# Altium project MB1189.PrjPCB (part 3 of 3)
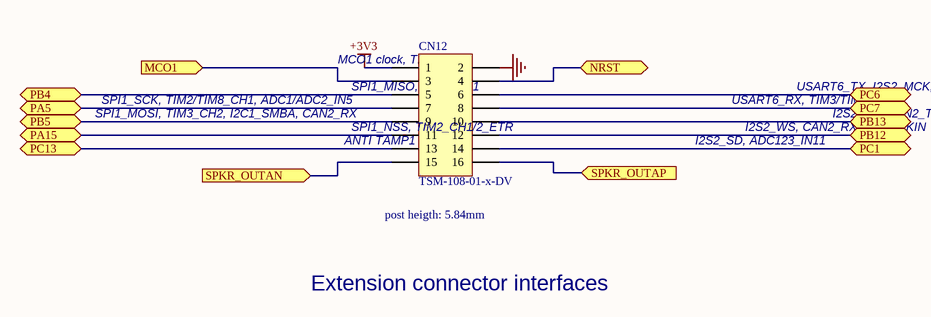
[diagram p13: ExtensionConnector.SchDoc]

## Nets that join several sheets
+1V8: Power (C32.1 U8.2 U8.4), AUDIO2 (7 pins)
+3V3: Memory (28 pins), Peripherals (15 pins), Power (C41.1 JP5.1 SB8.2 U8.3), ST_LINK_V2-1 (R33.1), MCU (7 pins), Arduino_ Connectors (CN6.2 CN6.4), DSI_LCD (9 pins), QSPI (C62.1 R55.2 U12.8), AUDIO2 (11 pins), USB_OTG_FS (R43.1 R153.2 R157.1 R158.2), ExtensionConnector (CN12.1)
+5V: Power (6 pins), ST_LINK_V2-1 (D1.1), Arduino_ Connectors (CN6.5), DSI_LCD (L1.1 SB13.1), USB_OTG_FS (U16.5)
E5V: Power (C35.1 JP2.1 U10.2 U10.4), ST_LINK_V2-1 (D2.1)
GND: Top (H1.1 H2.1 H3.1 H4.1), Memory (28 pins), Peripherals (7 pins), Power (12 pins), ST_LINK_V2-1 (34 pins), MCU (57 pins), Arduino_ Connectors (5 pins), DSI_LCD (12 pins), QSPI (C62.2 U12.4), AUDIO2 (28 pins), USB_OTG_FS (12 pins), ExtensionConnector (CN12.2)
U5V_ST_LINK: Power (JP2.3), ST_LINK_V2-1 (C14.2 U4.6 U4.7)
VBUS_FS1: Power (JP2.5), ST_LINK_V2-1 (D3.1), MCU (U14.E15), USB_OTG_FS (5 pins)
VDD_MCU: Power (JP5.2), MCU (40 pins)
VIN: Power (C36.1 U10.3), Arduino_ Connectors (CN6.8)
VREF+: MCU (C78.2 C80.1 R123.2 U14.P1), Arduino_ Connectors (C13.2 R41.1)
A0: Memory (U11.G8), MCU (U14.D2)
A1: Memory (U11.G9), MCU (U14.E2)
A2: Memory (U11.F7), MCU (U14.G2)
A3: Memory (U11.F3), MCU (U14.H2)
A4: Memory (U11.G1), MCU (U14.J2)
A5: Memory (U11.G2), MCU (U14.K3)
A6: Memory (U11.G3), MCU (U14.M6)
A7: Memory (U11.H1), MCU (U14.N6)
A8: Memory (U11.H2), MCU (U14.P6)
A9: Memory (U11.J3), MCU (U14.M8)
A10: Memory (U11.G7), MCU (U14.N7)
A11: Memory (U11.H9), MCU (U14.M7)
A14: Memory (U11.J7), MCU (U14.N12)
A15: Memory (U11.H8), MCU (U14.N11)
AUDIO_RST: MCU (U14.A3), AUDIO2 (R48.2 U5.32)
D0: Memory (TP4.1 U11.R8), MCU (TP1.1 U14.L12)
D1: Memory (U11.N7), MCU (U14.K13)
D2: Memory (U11.R9), MCU (U14.B12)
D3: Memory (U11.N8), MCU (U14.C12)
D4: Memory (U11.P9), MCU (U14.R8)
D5: Memory (U11.M8), MCU (U14.N9)
D6: Memory (U11.M7), MCU (U14.P9)
D7: Memory (U11.L8), MCU (U14.R9)
D8: Memory (U11.L2), MCU (U14.P10)
D9: Memory (U11.M3), MCU (U14.R10)
D10: Memory (U11.M2), MCU (U14.R12)
D11: Memory (U11.P1), MCU (U14.P11)
D12: Memory (U11.N2), MCU (U14.R11)
D13: Memory (U11.R1), MCU (U14.L15)
D14: Memory (U11.N3), MCU (U14.L14)
D15: Memory (U11.R2), MCU (U14.K15)
D16: Memory (U11.E8), MCU (U14.P14)
D17: Memory (U11.D7), MCU (U14.N14)
D18: Memory (U11.D8), MCU (U14.P15)
D19: Memory (U11.B9), MCU (U14.N15)
D20: Memory (U11.C8), MCU (U14.M15)
D21: Memory (U11.A9), MCU (U14.E12)
D22: Memory (U11.C7), MCU (U14.E13)
D23: Memory (U11.A8), MCU (U14.D13)
D24: Memory (U11.A2), MCU (U14.E14)
D25: Memory (U11.C3), MCU (U14.D14)
D26: Memory (U11.A1), MCU (U14.C14)
D27: Memory (U11.C2), MCU (U14.C13)
D28: Memory (U11.B1), MCU (U14.D6)
D29: Memory (U11.D2), MCU (U14.D4)
D30: Memory (U11.D3), MCU (U14.E4)
D31: Memory (U11.E2), MCU (U14.D5)
HSSI_CLK_N: MCU (U14.H13), DSI_LCD (CN10.12)
HSSI_CLK_P: MCU (U14.H12), DSI_LCD (CN10.14)
HSSI_D0_N: MCU (U14.J13), DSI_LCD (CN10.8)
HSSI_D0_P: MCU (U14.J12), DSI_LCD (CN10.10)
HSSI_D1_N: MCU (U14.F13), DSI_LCD (CN10.16)
HSSI_D1_P: MCU (U14.F12), DSI_LCD (CN10.18)
I2C1_SCL: Peripherals (CN11.3), MCU (R140.2 U14.A7), Arduino_ Connectors (CN5.10 SB11.1), DSI_LCD (CN2.3)
I2C1_SDA: Peripherals (CN11.1), MCU (R142.2 U14.B4), Arduino_ Connectors (CN5.9 SB9.1), DSI_LCD (CN2.4)
I2C2_SCL: MCU (R121.2 U14.H4), AUDIO2 (U5.2)
I2C2_SDA: MCU (R124.2 U14.J3), AUDIO2 (U5.1)
LCD_BL_CTRL: MCU (U14.R2), DSI_LCD (R119.2)
LCD_INT: MCU (U14.M14), DSI_LCD (CN2.2 R36.2)
LCD_RST: MCU (U14.N13), DSI_LCD (CN2.5 CN10.5 R34.2)
MIC_CK: MCU (R87.1), AUDIO2 (U1.3 U2.3 U6.3)
NRST: Peripherals (SB1.1), ST_LINK_V2-1 (SB2.2), MCU (U14.J1), Arduino_ Connectors (CN6.3), ExtensionConnector (CN12.4)
PA0: Peripherals (R18.2), MCU (U14.N3)
PA1: MCU (U14.N2), Arduino_ Connectors (CN7.4)
PA2: MCU (U14.P2), Arduino_ Connectors (CN7.6)
PA4: MCU (U14.N4), Arduino_ Connectors (SB12.1)
PA5: MCU (U14.P4), ExtensionConnector (CN12.7)
PA6: MCU (U14.P3), Arduino_ Connectors (CN7.7)
PA7: MCU (U14.R3), Arduino_ Connectors (CN5.2)
PA8: MCU (U14.F15), ExtensionConnector (CN12.3)
PA10: MCU (U14.D15), USB_OTG_FS (R161.2)
PA13: ST_LINK_V2-1 (R20.2 U3.27), MCU (U14.A15)
PA14: ST_LINK_V2-1 (U3.15 U3.26), MCU (U14.A14)
PA15: MCU (U14.A13), ExtensionConnector (CN12.11)
PB0: Peripherals (CN11.4), MCU (U14.R5)
PB1: MCU (U14.R4), Arduino_ Connectors (CN8.1)
PB2: MCU (U14.M5), USB_OTG_FS (R151.2)
PB4: MCU (U14.A9), ExtensionConnector (CN12.5)
PB5: MCU (U14.A8), ExtensionConnector (CN12.9)
PB6: MCU (U14.B6), QSPI (R55.1 U12.1)
PB7: MCU (U14.B5), USB_OTG_FS (R156.1)
PB10: ST_LINK_V2-1 (U3.13), MCU (U14.P12)
PB11: ST_LINK_V2-1 (U3.12), MCU (U14.R13)
PB12: MCU (U14.L13), ExtensionConnector (CN12.12)
PB13: MCU (U14.K14), ExtensionConnector (CN12.10)
PB14: MCU (U14.R14), Arduino_ Connectors (CN5.5)
PB15: MCU (U14.R15), Arduino_ Connectors (CN5.4)
PC0: Memory (TP2.1 U11.K8), MCU (U14.M2)
PC1: MCU (U14.M3), ExtensionConnector (CN12.14)
PC2: MCU (U14.M4), Arduino_ Connectors (CN8.2)
PC3: MCU (U14.L4), Arduino_ Connectors (CN8.3)
PC4: MCU (U14.N5), Arduino_ Connectors (CN8.4)
PC5: MCU (U14.P5), Arduino_ Connectors (SB10.1)
PC6: MCU (U14.H15), ExtensionConnector (CN12.6)
PC7: MCU (U14.G15), ExtensionConnector (CN12.8)
PC8: Peripherals (CN9.7 R114.2), MCU (U14.G14)
PC10: Peripherals (CN9.1 R120.2), MCU (U14.B14)
PC11: Peripherals (CN9.2 R116.2), MCU (U14.B13)
PC12: Peripherals (CN9.5), MCU (U14.A12)
PC13: MCU (U14.D1), ExtensionConnector (CN12.13)
PD2: Peripherals (CN9.3 R115.2), MCU (U14.D12)
PD3: MCU (U14.C11), Arduino_ Connectors (CN5.6 SB5.2)
PD4: Peripherals (R3.1), MCU (U14.D11)
PD5: Peripherals (R4.1), MCU (U14.C10)
PD6: MCU (U14.B11), AUDIO2 (SB17.2 SB18.2 U2.4)
PE0: Memory (U11.K9), MCU (U14.A6)
PE1: Memory (U11.K1), MCU (U14.A5)
PE3: MCU (U14.A2), AUDIO2 (R46.2)
PE4: MCU (U14.A1), AUDIO2 (U5.40)
PE5: MCU (U14.B1), AUDIO2 (U5.38)
PE6: MCU (U14.B2), AUDIO2 (U5.39)
PF6: MCU (U14.K2), QSPI (U12.7)
PF7: MCU (U14.K1), QSPI (U12.3)
PF8: MCU (U14.L3), QSPI (TP6.1 U12.5)
PF9: MCU (U14.L2), QSPI (TP7.1 U12.2)
PF10: MCU (U14.L1), QSPI (TP5.1 U12.6)
PF11: Memory (U11.J9), MCU (U14.P8)
PG2: Peripherals (R57.1), MCU (U14.M13)
PG6: Peripherals (R2.1), MCU (U14.J15)
PG7: MCU (U14.J14), AUDIO2 (U5.37)
PG8: Memory (TP3.1 U11.J1), MCU (U14.H14)
PG9: MCU (U14.D9), Arduino_ Connectors (CN7.1)
PG10: MCU (U14.C8), Arduino_ Connectors (CN5.1)
PG11: MCU (U14.B8), Arduino_ Connectors (CN7.8)
PG12: MCU (U14.C7), Arduino_ Connectors (CN7.5)
PG13: MCU (U14.B3), Arduino_ Connectors (CN7.3)
PG14: MCU (U14.A4), Arduino_ Connectors (CN7.2)
PG15: Memory (U11.K7), MCU (U14.B7)
PH2: Memory (U11.J2), MCU (U14.K4)
PH3: Memory (U11.J8), MCU (U14.J4)
PH6: MCU (U14.P13), Arduino_ Connectors (CN5.3)
PI4: Memory (U11.F8), MCU (U14.C3)
PI5: Memory (U11.F2), MCU (U14.D3)
PJ2: MCU (U14.P7), DSI_LCD (CN10.22)
PK3: Peripherals (R5.1), MCU (U14.D8)
SPKR_OUTAN: AUDIO2 (U5.6), ExtensionConnector (CN12.15)
SPKR_OUTAP: AUDIO2 (U5.4), ExtensionConnector (CN12.16)
STLK_MCO: ST_LINK_V2-1 (C26.1 R35.2), MCU (SB19.1)
SWO: ST_LINK_V2-1 (SB3.2), MCU (SB7.1)
USB_FS1_N: MCU (U14.C15), USB_OTG_FS (D5.D3 R160.2)
USB_FS1_P: MCU (U14.B15), USB_OTG_FS (D5.C3 R159.2)
uSD_D1: Peripherals (CN9.8 R86.2), MCU (R135.2)

## Assembly variants
F469NIH6: not fitted C4 C13 C26 CN4 R29 R31 R34 R43 R119 R144 R150 TP1 TP2 TP3 TP4 TP5 TP6 TP7